# EAGLE schematic pureVCO (EAGLE 9.0.1)

## Sheet 1 of 6: Core
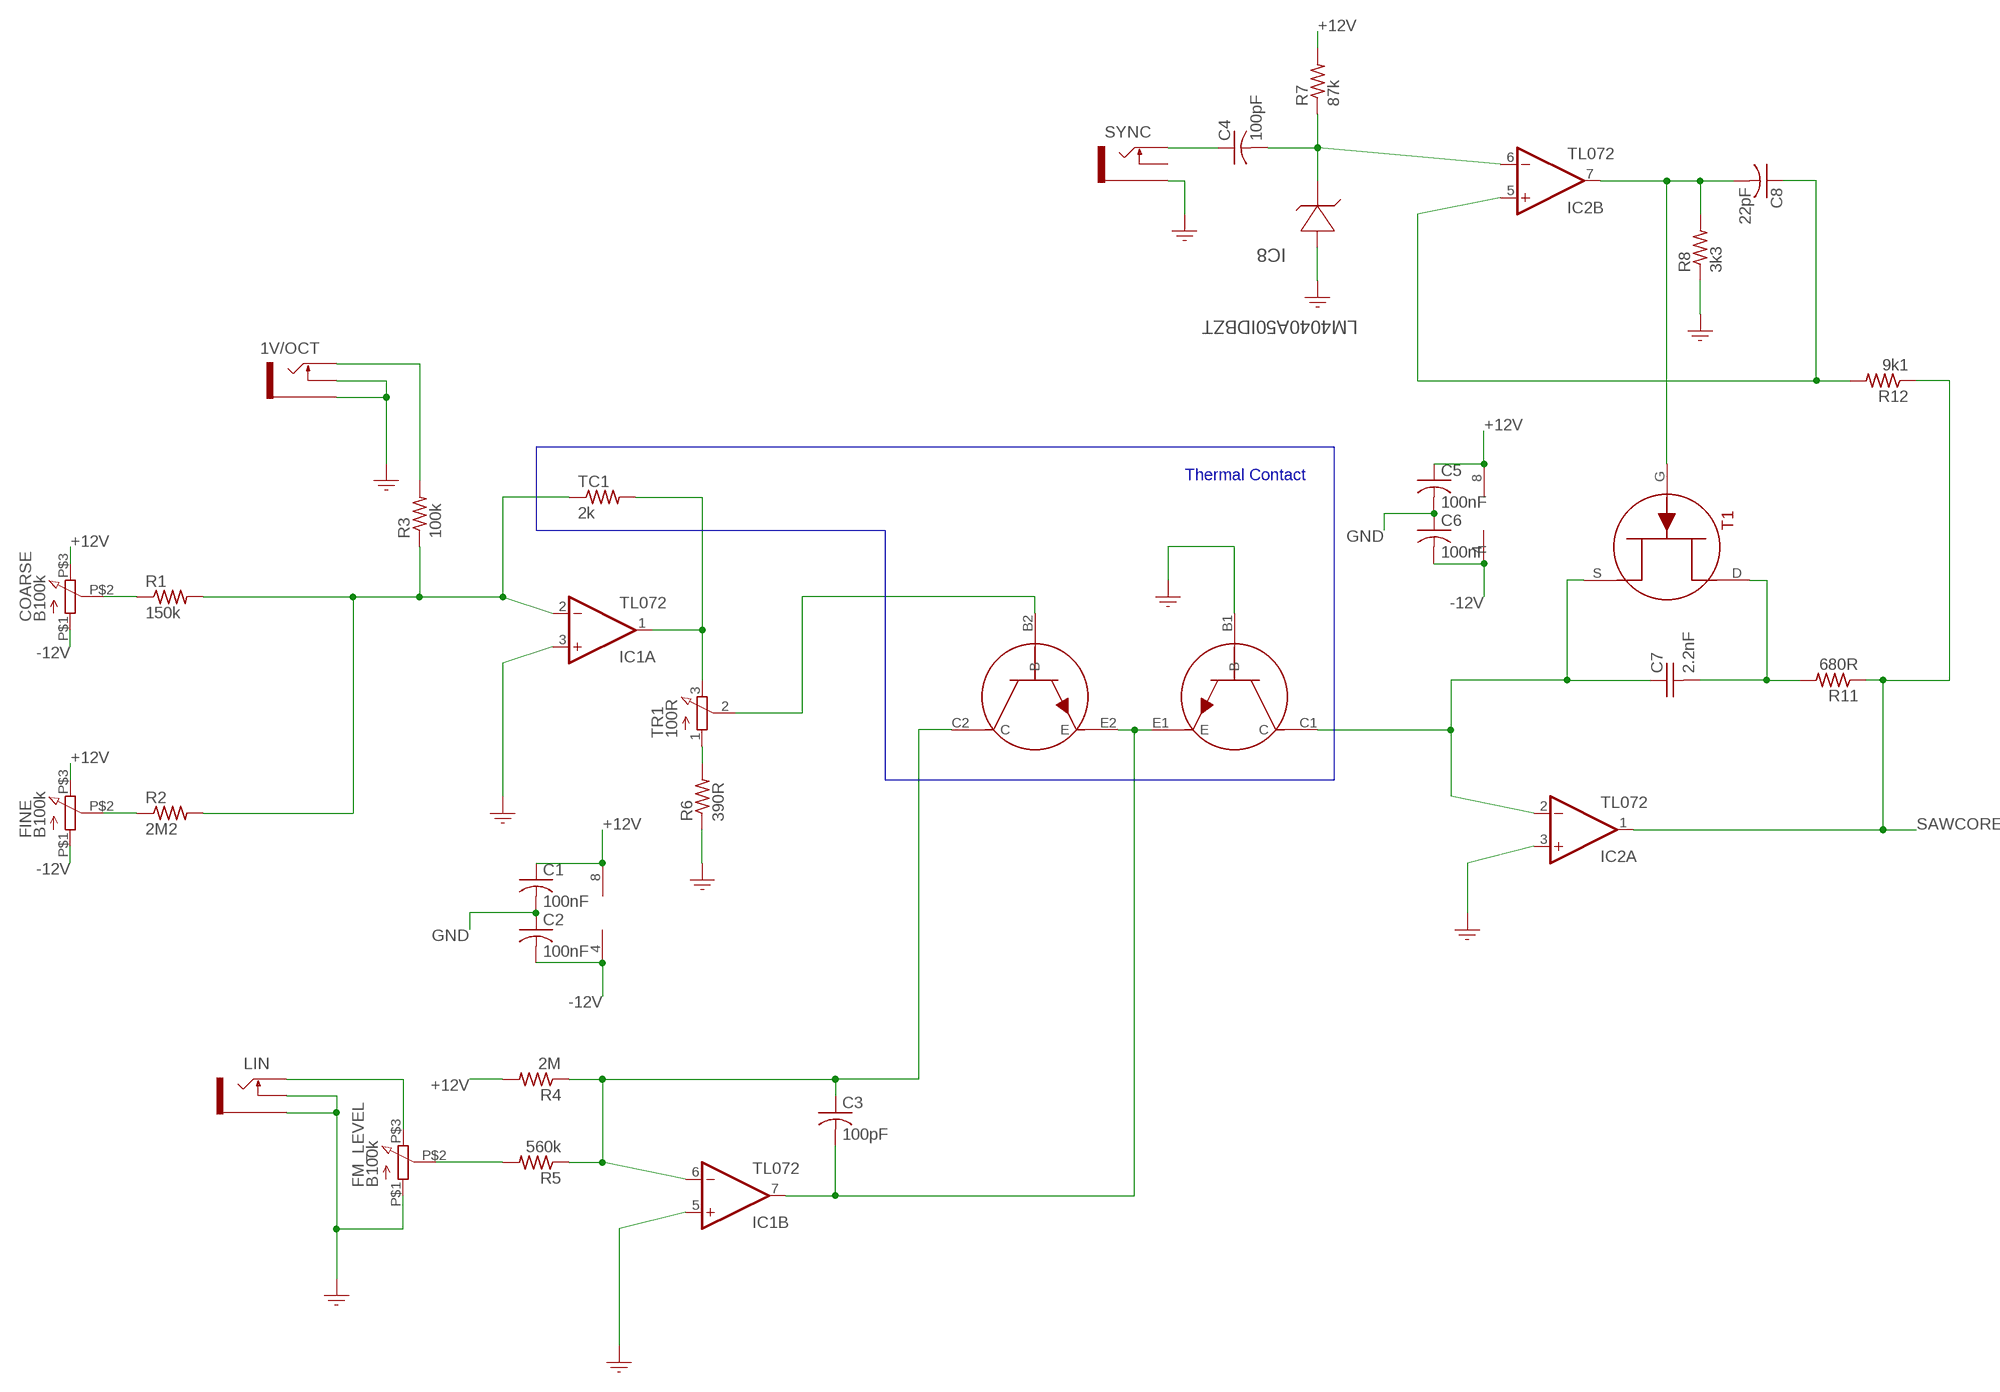
[diagram p0: schematic, sheet 1]

### Parts
1V/OCT  PJ301M-12  SOCKET_MONO_3.5MMPJ301M-12  [PJ301M-12]
C1  100nF  CAPACITOR-USC0805  [C0805]
C2  100nF  CAPACITOR-USC0805  [C0805]
C3  100pF  CAPACITOR-USC0805  [C0805]
C4  100pF  CAPACITOR-USC0805  [C0805]
C5  100nF  CAPACITOR-USC0805  [C0805]
C6  100nF  CAPACITOR-USC0805  [C0805]
C7  2.2nF  CAPACITOR_POLYFILM  [POLY_CAP]
C8  22pF  CAPACITOR-USC0805  [C0805]
COARSE  B100k  RESISTOR_VARIABLE9MM_POT  [POTENTIOMETER_9MM]
FINE  B100k  RESISTOR_VARIABLE9MM_POT  [POTENTIOMETER_9MM]
FM_LEVEL  B100k  RESISTOR_VARIABLE9MM_POT  [POTENTIOMETER_9MM]
IC1  TL072  OPAMP_DUALD  [SO08]
IC2  TL072  OPAMP_DUALD  [SO08]
IC8  LM4040A50IDBZT  VOLTAGE_REF  [SOT95P237X112-3N]
LIN  PJ301M-12  SOCKET_MONO_3.5MMPJ301M-12  [PJ301M-12]
R1  150k  RESISTOR_USR0805  [R0805]
R2  2M2  RESISTOR_USR0805  [R0805]
R3  100k  RESISTOR_USR0805  [R0805]
R4  2M  RESISTOR_USR0805  [R0805]
R5  560k  RESISTOR_USR0805  [R0805]
R6  390R  RESISTOR_USR0805  [R0805]
R7  87k  RESISTOR_USR0805  [R0805]
R8  3k3  RESISTOR_USR0805  [R0805]
R11  680R  RESISTOR_USR0805  [R0805]
R12  9k1  RESISTOR_USR0805  [R0805]
SYNC  PJ301M-12  SOCKET_MONO_3.5MMPJ301M-12  [PJ301M-12]
T1  MMBFJ309  TRANSISTOR_JFET_N_CHN  [N_CHN]
TC1  2k  RESISTOR_US0204/7  [0204/7]
TP1  DMMT3904W-7-F  TRANSISTOR_PAIR_NPN  [TRANS_PAIR]
TR1  100R  RESISTOR_VARIABLETRIMMER_TH  [TRIMMER_TH]

### Nets
+12V: C1.1 C5.1 COARSE.P$3 FINE.P$3 IC1.8(P:V+) IC2.8(P:V+) R4.2 R7.2 ; also sheet 2,3,4,5,6
-12V: C2.2 C6.2 COARSE.P$1 FINE.P$1 IC1.4(P:V-) IC2.4(P:V-) ; also sheet 2,3,4,5,6
GND: 1V/OCT.GND(SLEEVE) 1V/OCT.NORM(SWITCH) C1.2 C2.1 C5.2 C6.1 FM_LEVEL.P$1 IC1.3(A:+IN) IC1.5(B:+IN) IC2.3(A:+IN) IC8.2(ANODE) LIN.GND(SLEEVE) LIN.NORM(SWITCH) R6.1 R8.1 SYNC.GND(SLEEVE) TP1.B1(B) ; also sheet 2,3,4,5,6
N$2: COARSE.P$2 R1.1
N$4: IC1.2(A:-IN) R1.2 R2.2 R3.1 TC1.1
N$5: FINE.P$2 R2.1
N$7: IC1.1(A:OUT) TC1.2 TR1.3
N$8: R6.2 TR1.1
N$9: 1V/OCT.TIP R3.2
N$10: TP1.B2(B) TR1.2
N$11: C7.2(-) R11.2 T1.D
N$12: C3.1 IC1.6(B:-IN) R4.1 R5.1 TP1.C2(C)
N$13: C7.1(+) IC2.2(A:-IN) T1.S TP1.C1(C)
N$15: FM_LEVEL.P$3 LIN.TIP
N$16: C8.1 IC2.5(B:+IN) R12.2
N$17: FM_LEVEL.P$2 R5.2
N$18: C3.2 IC1.7(B:OUT) TP1.E1(E) TP1.E2(E)
N$20: C8.2 IC2.7(B:OUT) R8.2 T1.G
N$21: C4.1 SYNC.TIP
N$22: C4.2 IC2.6(B:-IN) IC8.1(CATHODE) R7.1
SAWCORE: IC2.1(A:OUT) R11.1 R12.1 ; also sheet 2
Unconnected: IC8.3(NC) SYNC.NORM(SWITCH)

### Buses
B$1

### Notes on the sheet
- Thermal Contact

## Sheet 2 of 6: Saw and Triangle Shaping
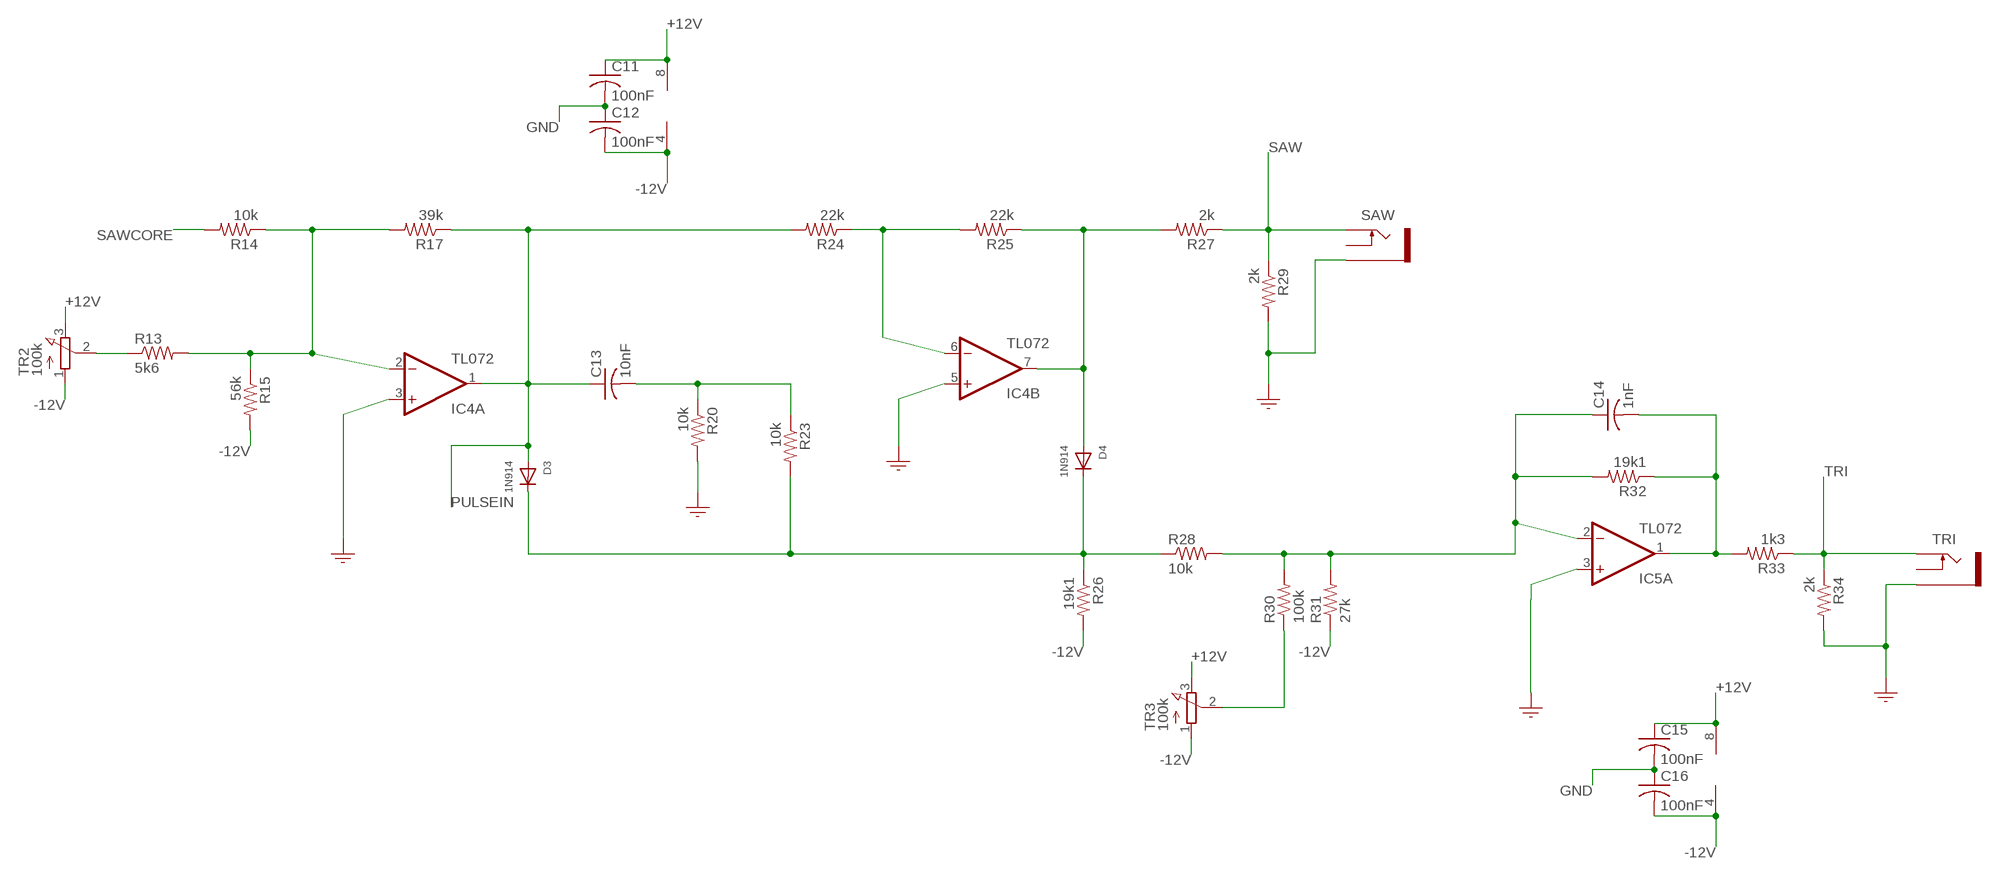
[diagram p1: schematic, sheet 2]

### Parts
C11  100nF  CAPACITOR-USC0805  [C0805]
C12  100nF  CAPACITOR-USC0805  [C0805]
C13  10nF  CAPACITOR-USC0805  [C0805]
C14  1nF  CAPACITOR-USC0805  [C0805]
C15  100nF  CAPACITOR-USC0805  [C0805]
C16  100nF  CAPACITOR-USC0805  [C0805]
D3  1N914  DIODESOD-323F  [SOD-323F]
D4  1N914  DIODESOD-323F  [SOD-323F]
IC4  TL072  OPAMP_DUALD  [SO08]
IC5  TL072  OPAMP_DUALD  [SO08]
R13  5k6  RESISTOR_USR0805  [R0805]
R14  10k  RESISTOR_USR0805  [R0805]
R15  56k  RESISTOR_USR0805  [R0805]
R17  39k  RESISTOR_USR0805  [R0805]
R20  10k  RESISTOR_USR0805  [R0805]
R23  10k  RESISTOR_USR0805  [R0805]
R24  22k  RESISTOR_USR0805  [R0805]
R25  22k  RESISTOR_USR0805  [R0805]
R26  19k1  RESISTOR_USR0805  [R0805]
R27  2k  RESISTOR_USR0805  [R0805]
R28  10k  RESISTOR_USR0805  [R0805]
R29  2k  RESISTOR_USR0805  [R0805]
R30  100k  RESISTOR_USR0805  [R0805]
R31  27k  RESISTOR_USR0805  [R0805]
R32  19k1  RESISTOR_USR0805  [R0805]
R33  1k3  RESISTOR_USR0805  [R0805]
R34  2k  RESISTOR_USR0805  [R0805]
SAW  PJ301M-12  SOCKET_MONO_3.5MMPJ301M-12  [PJ301M-12]
TR2  100k  RESISTOR_VARIABLETRIMMER_TH  [TRIMMER_TH]
TR3  100k  RESISTOR_VARIABLETRIMMER_TH  [TRIMMER_TH]
TRI  PJ301M-12  SOCKET_MONO_3.5MMPJ301M-12  [PJ301M-12]

### Nets
+12V: C11.1 C15.1 IC4.8(P:V+) IC5.8(P:V+) TR2.3 TR3.3 ; also sheet 1,3,4,5,6
-12V: C12.2 C16.2 IC4.4(P:V-) IC5.4(P:V-) R15.2 R26.2 R31.1 TR2.1 TR3.1 ; also sheet 1,3,4,5,6
GND: C11.2 C12.1 C15.2 C16.1 IC4.3(A:+IN) IC4.5(B:+IN) IC5.3(A:+IN) R20.2 R29.2 R34.2 SAW.GND(SLEEVE) TRI.GND(SLEEVE) ; also sheet 1,3,4,5,6
N$23: R13.1 TR2.2
N$24: IC4.2(A:-IN) R13.2 R14.1 R15.1 R17.2
N$28: C13.2 R20.1 R23.1
N$29: R30.1 TR3.2
N$30: IC4.6(B:-IN) R24.1 R25.2
N$31: D4.A IC4.7(B:OUT) R25.1 R27.2
N$33: D3.C D4.C R23.2 R26.1 R28.1
N$34: C14.1 IC5.2(A:-IN) R28.2 R30.2 R31.2 R32.2
N$37: C14.2 IC5.1(A:OUT) R32.1 R33.2
PULSEIN: C13.1 D3.A IC4.1(A:OUT) R17.1 R24.2 ; also sheet 3
SAW: R27.1 R29.1 SAW.TIP ; also sheet 5
SAWCORE: R14.2 ; also sheet 1
TRI: R33.1 R34.1 TRI.TIP ; also sheet 4,5
Unconnected: SAW.NORM(SWITCH) TRI.NORM(SWITCH)

## Sheet 3 of 6: Pulse and PWM Shaping
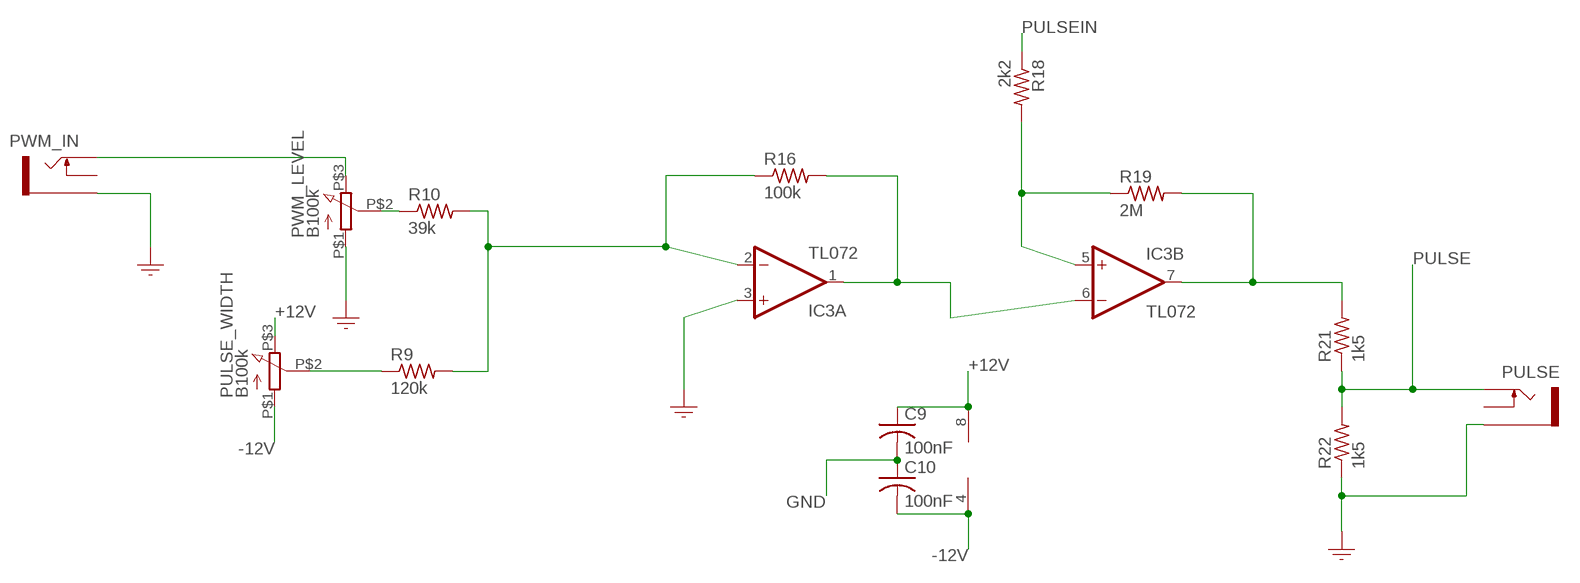
[diagram p2: schematic, sheet 3]

### Parts
C9  100nF  CAPACITOR-USC0805  [C0805]
C10  100nF  CAPACITOR-USC0805  [C0805]
IC3  TL072  OPAMP_DUALD  [SO08]
PULSE  PJ301M-12  SOCKET_MONO_3.5MMPJ301M-12  [PJ301M-12]
PULSE_WIDTH  B100k  RESISTOR_VARIABLE9MM_POT  [POTENTIOMETER_9MM]
PWM_IN  PJ301M-12  SOCKET_MONO_3.5MMPJ301M-12  [PJ301M-12]
PWM_LEVEL  B100k  RESISTOR_VARIABLE9MM_POT  [POTENTIOMETER_9MM]
R9  120k  RESISTOR_USR0805  [R0805]
R10  39k  RESISTOR_USR0805  [R0805]
R16  100k  RESISTOR_USR0805  [R0805]
R18  2k2  RESISTOR_USR0805  [R0805]
R19  2M  RESISTOR_USR0805  [R0805]
R21  1k5  RESISTOR_USR0805  [R0805]
R22  1k5  RESISTOR_USR0805  [R0805]

### Nets
+12V: C9.1 IC3.8(P:V+) PULSE_WIDTH.P$3 ; also sheet 1,2,4,5,6
-12V: C10.2 IC3.4(P:V-) PULSE_WIDTH.P$1 ; also sheet 1,2,4,5,6
GND: C9.2 C10.1 IC3.3(A:+IN) PULSE.GND(SLEEVE) PWM_IN.GND(SLEEVE) PWM_LEVEL.P$1 R22.1 ; also sheet 1,2,4,5,6
N$6: IC3.1(A:OUT) IC3.6(B:-IN) R16.2
N$36: IC3.5(B:+IN) R18.2 R19.1
N$39: IC3.7(B:OUT) R19.2 R21.2
N$40: PULSE_WIDTH.P$2 R9.1
N$41: PWM_IN.TIP PWM_LEVEL.P$3
N$42: IC3.2(A:-IN) R9.2 R10.2 R16.1
N$46: PWM_LEVEL.P$2 R10.1
PULSE: PULSE.TIP R21.1 R22.2 ; also sheet 5
PULSEIN: R18.1 ; also sheet 2
Unconnected: PULSE.NORM(SWITCH) PWM_IN.NORM(SWITCH)

## Sheet 4 of 6: Sine Shaping
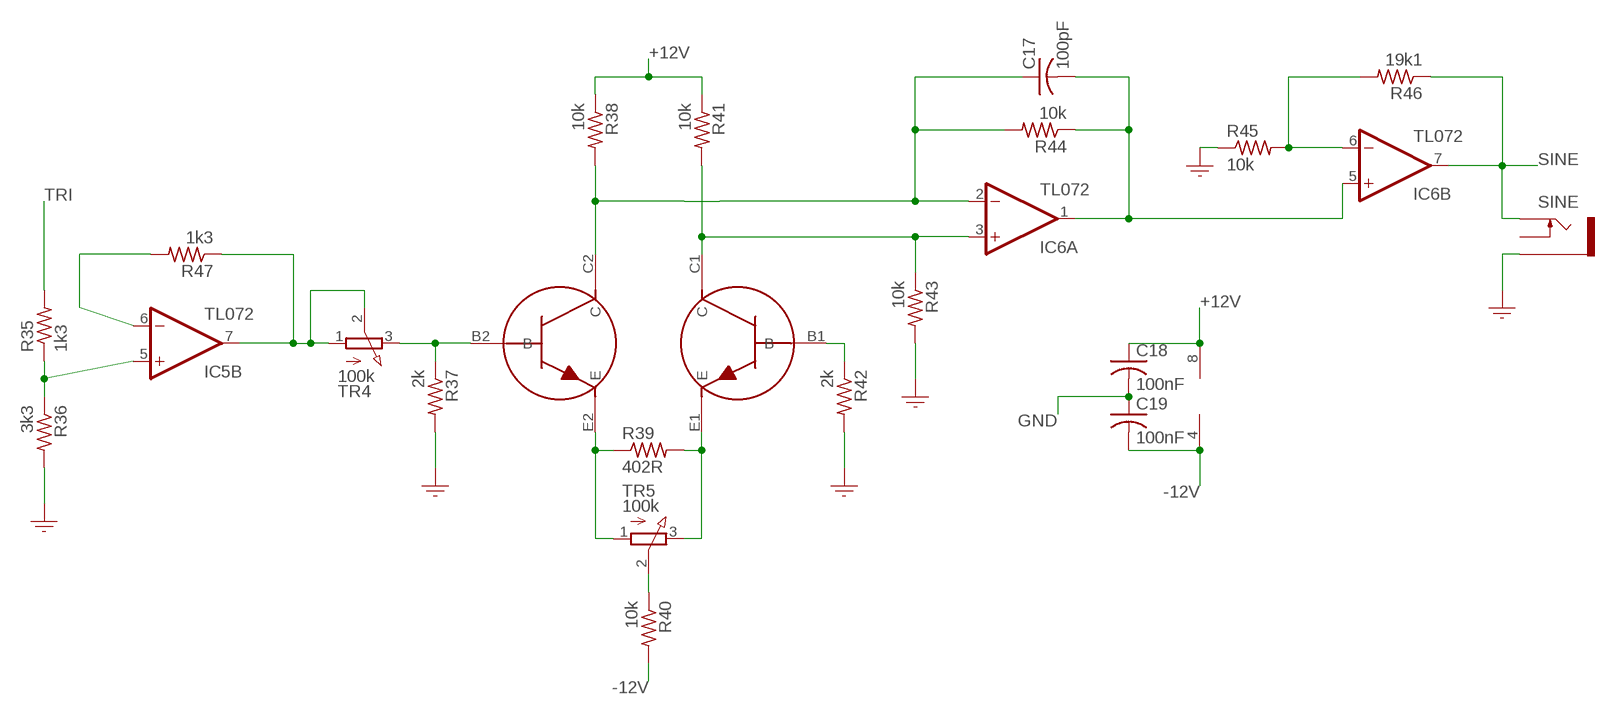
[diagram p3: schematic, sheet 4]

### Parts
C17  100pF  CAPACITOR-USC0805  [C0805]
C18  100nF  CAPACITOR-USC0805  [C0805]
C19  100nF  CAPACITOR-USC0805  [C0805]
IC6  TL072  OPAMP_DUALD  [SO08]
R35  1k3  RESISTOR_USR0805  [R0805]
R36  3k3  RESISTOR_USR0805  [R0805]
R37  2k  RESISTOR_USR0805  [R0805]
R38  10k  RESISTOR_USR0805  [R0805]
R39  402R  RESISTOR_USR0805  [R0805]
R40  10k  RESISTOR_USR0805  [R0805]
R41  10k  RESISTOR_USR0805  [R0805]
R42  2k  RESISTOR_USR0805  [R0805]
R43  10k  RESISTOR_USR0805  [R0805]
R44  10k  RESISTOR_USR0805  [R0805]
R45  10k  RESISTOR_USR0805  [R0805]
R46  19k1  RESISTOR_USR0805  [R0805]
R47  1k3  RESISTOR_USR0805  [R0805]
SINE  PJ301M-12  SOCKET_MONO_3.5MMPJ301M-12  [PJ301M-12]
TP2  DMMT3904W-7-F  TRANSISTOR_PAIR_NPN  [TRANS_PAIR]
TR4  100k  RESISTOR_VARIABLETRIMMER_TH  [TRIMMER_TH]
TR5  100k  RESISTOR_VARIABLETRIMMER_TH  [TRIMMER_TH]

### Nets
+12V: C18.1 IC6.8(P:V+) R38.1 R41.1 ; also sheet 1,2,3,5,6
-12V: C19.2 IC6.4(P:V-) R40.2 ; also sheet 1,2,3,5,6
GND: C18.2 C19.1 R36.2 R37.2 R42.2 R43.2 R45.1 SINE.GND(SLEEVE) ; also sheet 1,2,3,5,6
N$14: C17.1 IC6.2(A:-IN) R38.2 R44.2 TP2.C2(C)
N$19: IC5.6(B:-IN) R47.2
N$75: IC5.7(B:OUT) R47.1 TR4.1 TR4.2
N$76: R37.1 TP2.B2(B) TR4.3
N$77: R39.1 TP2.E2(E) TR5.1
N$78: R39.2 TP2.E1(E) TR5.3
N$79: R40.1 TR5.2
N$80: R42.1 TP2.B1(B)
N$82: IC6.3(A:+IN) R41.2 R43.1 TP2.C1(C)
N$83: IC5.5(B:+IN) R35.1 R36.1
N$84: IC6.6(B:-IN) R45.2 R46.2
SINE: IC6.7(B:OUT) R46.1 SINE.TIP ; also sheet 5
SINE_PRE1: C17.2 IC6.1(A:OUT) IC6.5(B:+IN) R44.1
TRI: R35.2 ; also sheet 2,5
Unconnected: SINE.NORM(SWITCH)

## Sheet 5 of 6: Mixer
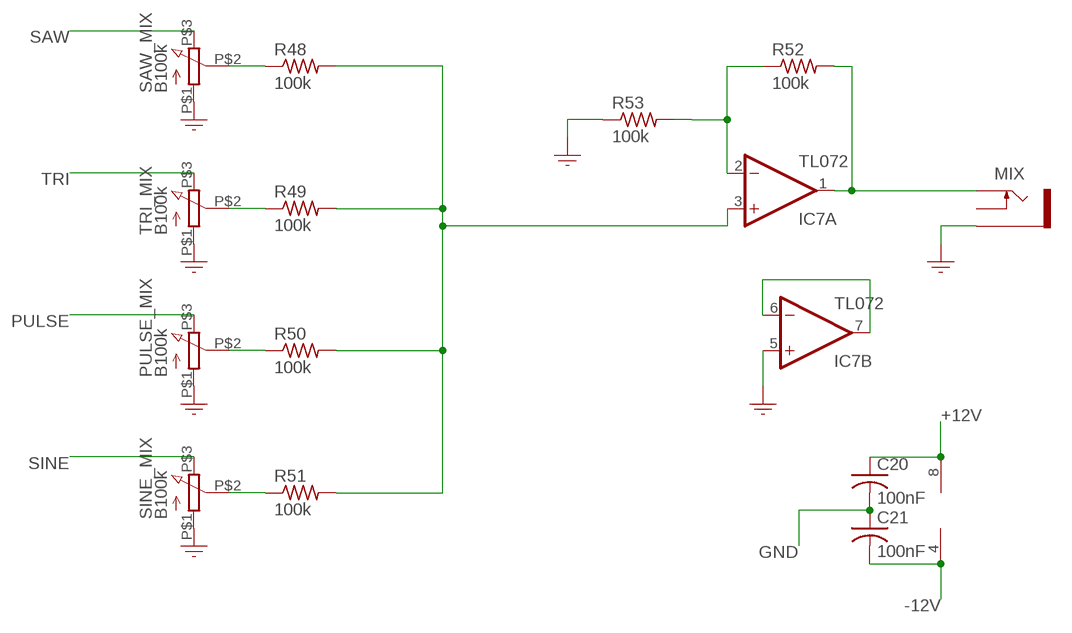
[diagram p4: schematic, sheet 5]

### Parts
C20  100nF  CAPACITOR-USC0805  [C0805]
C21  100nF  CAPACITOR-USC0805  [C0805]
IC7  TL072  OPAMP_DUALD  [SO08]
MIX  PJ301M-12  SOCKET_MONO_3.5MMPJ301M-12  [PJ301M-12]
PULSE_MIX  B100k  RESISTOR_VARIABLE9MM_POT  [POTENTIOMETER_9MM]
R48  100k  RESISTOR_USR0805  [R0805]
R49  100k  RESISTOR_USR0805  [R0805]
R50  100k  RESISTOR_USR0805  [R0805]
R51  100k  RESISTOR_USR0805  [R0805]
R52  100k  RESISTOR_USR0805  [R0805]
R53  100k  RESISTOR_USR0805  [R0805]
SAW_MIX  B100k  RESISTOR_VARIABLE9MM_POT  [POTENTIOMETER_9MM]
SINE_MIX  B100k  RESISTOR_VARIABLE9MM_POT  [POTENTIOMETER_9MM]
TRI_MIX  B100k  RESISTOR_VARIABLE9MM_POT  [POTENTIOMETER_9MM]

### Nets
+12V: C20.1 IC7.8(P:V+) ; also sheet 1,2,3,4,6
-12V: C21.2 IC7.4(P:V-) ; also sheet 1,2,3,4,6
GND: C20.2 C21.1 IC7.5(B:+IN) MIX.GND(SLEEVE) PULSE_MIX.P$1 R53.1 SAW_MIX.P$1 SINE_MIX.P$1 TRI_MIX.P$1 ; also sheet 1,2,3,4,6
N$25: IC7.6(B:-IN) IC7.7(B:OUT)
N$35: IC7.3(A:+IN) R48.2 R49.2 R50.2 R51.2
N$38: R48.1 SAW_MIX.P$2
N$43: R49.1 TRI_MIX.P$2
N$44: PULSE_MIX.P$2 R50.1
N$45: R51.1 SINE_MIX.P$2
N$48: IC7.2(A:-IN) R52.1 R53.2
N$49: IC7.1(A:OUT) MIX.TIP R52.2
PULSE: PULSE_MIX.P$3 ; also sheet 3
SAW: SAW_MIX.P$3 ; also sheet 2
SINE: SINE_MIX.P$3 ; also sheet 4
TRI: TRI_MIX.P$3 ; also sheet 2,4
Unconnected: MIX.NORM(SWITCH)

## Sheet 6 of 6: Power
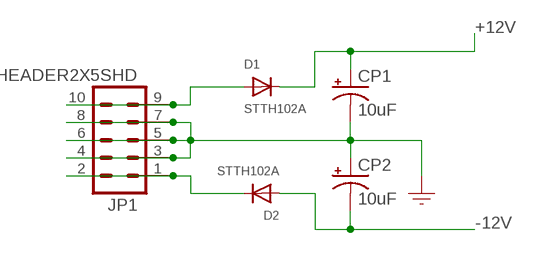
[diagram p5: schematic, sheet 6]

### Parts
CP1  10uF  CAPACITOR_POL-US153CLV-0505  [153CLV-0505]
CP2  10uF  CAPACITOR_POL-US153CLV-0505  [153CLV-0505]
D1  STTH102A  DIODESMA  [SMADIODE]
D2  STTH102A  DIODESMA  [SMADIODE]
JP1  HEADER2X5SHD  [2X5-SHROUDED]

### Nets
+12V: CP1.+ D1.C ; also sheet 1,2,3,4,5
-12V: CP2.- D2.A ; also sheet 1,2,3,4,5
GND: CP1.- CP2.+ JP1.3 JP1.4 JP1.5 JP1.6 JP1.7 JP1.8 ; also sheet 1,2,3,4,5
N$1: D1.A JP1.9 JP1.10
N$3: D2.C JP1.1 JP1.2

## Library data of the parts
1V/OCT LIN MIX PULSE PWM_IN SAW SINE SYNC TRI = GMSN:SOCKET_MONO_3.5MM: 3.5 mm Jack Socket; SORT: 8
C1-C6 C8-C21 = GMSN:CAPACITOR-US: Capacitor; SORT: 3
C7 = GMSN:CAPACITOR_POLYFILM: Poly Film Capacitor; SORT: 7
COARSE FINE FM_LEVEL PULSE_MIX PULSE_WIDTH PWM_LEVEL SAW_MIX SINE_MIX TRI_MIX = GMSN:RESISTOR_VARIABLE: Potentiometer; SORT: 8
CP1 CP2 = GMSN:CAPACITOR_POL-US: Electro Capacitor; SORT: 6
D1 D2 = GMSN:DIODE: Diode SMADIODE - SMA Surface Mount Package 20V 1A Schottky Diode Digikey: 641-1014-6-ND DO-1N4148 - Through Hole Small Current Diode SOD-123 20V 1 A (.5mV Vf) Schottky Diode - Digikey: MBRX120TPMSCT-ND SOD-323 10V 570mA (.38mV Vf, 3ns) Schottky Diode - Digikey: ZLLS410CT-ND SOD-523 30V 30mA Schottky Diode (RB751S-40TE61) - Digikey: RB751S-40TE61CT-ND SOT23-R/W - SOT23 Package (R = Solder Paste/Reflow Ovens, W = Hand-Soldering) BAT54Film 40V 300mA - Digikey: 497-7162-1-ND; SORT: 1
D3 D4 = GMSN:DIODE: Diode SMADIODE - SMA Surface Mount Package 20V 1A Schottky Diode Digikey: 641-1014-6-ND DO-1N4148 - Through Hole Small Current Diode SOD-123 20V 1 A (.5mV Vf) Schottky Diode - Digikey: MBRX120TPMSCT-ND SOD-323 10V 570mA (.38mV Vf, 3ns) Schottky Diode - Digikey: ZLLS410CT-ND SOD-523 30V 30mA Schottky Diode (RB751S-40TE61) - Digikey: RB751S-40TE61CT-ND SOT23-R/W - SOT23 Package (R = Solder Paste/Reflow Ovens, W = Hand-Soldering) BAT54Film 40V 300mA - Digikey: 497-7162-1-ND
IC1-IC7 = GMSN:OPAMP_DUAL: OP AMP; SORT: 4
IC8 = GMSN:VOLTAGE_REF: Shunt Voltage Reference; SORT: 4
JP1 = GMSN:HEADER2X5: Header 5x2 Standard 10-pin dual row 0.1" header. Commonly used with AVR-ISP. Use with Spark Fun Electronics SKU: PRT-00778; SORT: 7
R1-R53 = GMSN:RESISTOR_US: Resistor; SORT: 2
T1 = GMSN:TRANSISTOR_JFET_N_CHN: N Channel JFET; SORT: 4
TC1 = GMSN:RESISTOR_US: Resistor; SORT: 4
TP1 TP2 = GMSN:TRANSISTOR_PAIR_NPN: NPN Transistor Matched Pair; SORT: 4
TR1-TR5 = GMSN:RESISTOR_VARIABLE: Potentiometer; SORT: 7